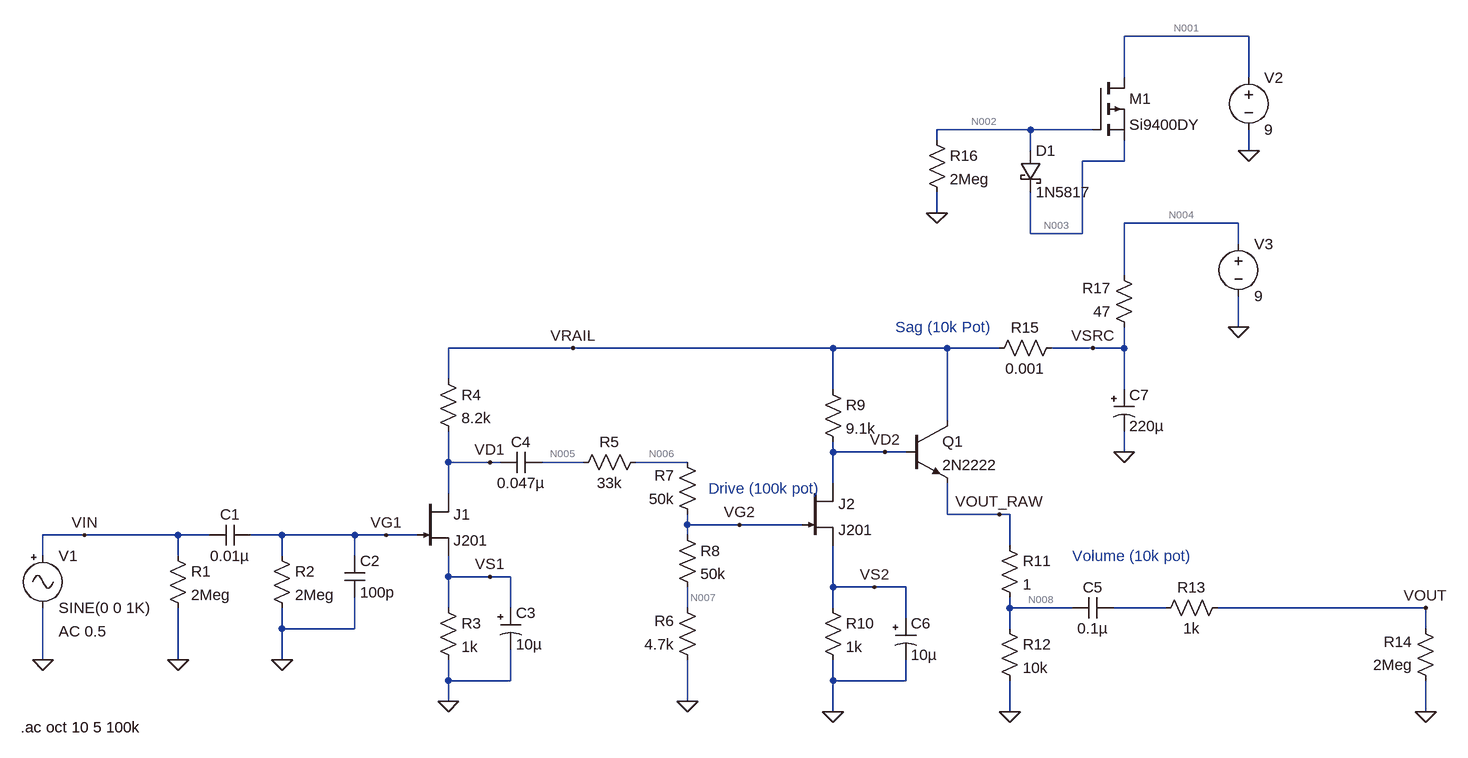
[diagram p0: schematic fairfield_barbershop.asc]
fairfield_barbershop.asc, the LTspice schematic file:
Version 4
SHEET 1 2060 680
WIRE 1664 -608 1472 -608
WIRE 1472 -544 1472 -608
WIRE 1664 -544 1664 -608
WIRE 1328 -464 1184 -464
WIRE 1424 -464 1328 -464
WIRE 1184 -448 1184 -464
WIRE 1328 -432 1328 -464
WIRE 1664 -432 1664 -464
WIRE 1472 -416 1472 -448
WIRE 1472 -416 1408 -416
WIRE 1184 -336 1184 -368
WIRE 1648 -320 1472 -320
WIRE 1328 -304 1328 -368
WIRE 1408 -304 1408 -416
WIRE 1408 -304 1328 -304
WIRE 1648 -288 1648 -320
WIRE 1472 -240 1472 -320
WIRE 1648 -160 1648 -208
WIRE 624 -128 432 -128
WIRE 1024 -128 624 -128
WIRE 1200 -128 1024 -128
WIRE 1280 -128 1200 -128
WIRE 1424 -128 1360 -128
WIRE 1472 -128 1472 -160
WIRE 1472 -128 1424 -128
WIRE 432 -80 432 -128
WIRE 1024 -64 1024 -128
WIRE 1472 -64 1472 -128
WIRE 1200 -16 1200 -128
WIRE 1024 32 1024 16
WIRE 1104 32 1024 32
WIRE 1136 32 1104 32
WIRE 1472 32 1472 0
WIRE 432 48 432 0
WIRE 496 48 432 48
WIRE 512 48 496 48
WIRE 640 48 576 48
WIRE 800 48 720 48
WIRE 1024 80 1024 32
WIRE 432 96 432 48
WIRE 1200 128 1200 80
WIRE 1280 128 1200 128
WIRE 1296 128 1280 128
WIRE 800 144 800 128
WIRE 880 144 800 144
WIRE 976 144 880 144
WIRE -128 160 -192 160
WIRE 16 160 -128 160
WIRE 64 160 16 160
WIRE 176 160 128 160
WIRE 288 160 176 160
WIRE 336 160 288 160
WIRE 384 160 336 160
WIRE 800 160 800 144
WIRE 1296 176 1296 128
WIRE -192 192 -192 160
WIRE 16 192 16 160
WIRE 176 192 176 160
WIRE 288 192 288 160
WIRE 432 224 432 192
WIRE 496 224 432 224
WIRE 528 224 496 224
WIRE 1024 240 1024 176
WIRE 1088 240 1024 240
WIRE 1136 240 1088 240
WIRE 432 272 432 224
WIRE 528 272 528 224
WIRE 800 272 800 240
WIRE 1024 272 1024 240
WIRE 1296 272 1296 256
WIRE 1392 272 1296 272
WIRE 1536 272 1456 272
WIRE 1936 272 1616 272
WIRE 1136 288 1136 240
WIRE 176 304 176 272
WIRE 288 304 288 256
WIRE 288 304 176 304
WIRE 1296 304 1296 272
WIRE 1936 304 1936 272
WIRE -192 352 -192 272
WIRE 16 352 16 272
WIRE 176 352 176 304
WIRE 432 384 432 352
WIRE 528 384 528 336
WIRE 528 384 432 384
WIRE 1024 384 1024 352
WIRE 1136 384 1136 352
WIRE 1136 384 1024 384
WIRE 432 416 432 384
WIRE 800 416 800 352
WIRE 1024 432 1024 384
WIRE 1296 432 1296 384
WIRE 1936 432 1936 384
FLAG -192 352 0
FLAG 16 352 0
FLAG 176 352 0
FLAG 432 416 0
FLAG 800 416 0
FLAG 1936 432 0
FLAG 1296 432 0
FLAG 1024 432 0
FLAG 1936 272 VOUT
FLAG -128 160 VIN
FLAG 1184 -336 0
FLAG 1472 32 0
FLAG 1664 -432 0
FLAG 624 -128 VRAIL
FLAG 1424 -128 VSRC
FLAG 880 144 VG2
FLAG 1104 32 VD2
FLAG 1280 128 VOUT_RAW
FLAG 1648 -160 0
FLAG 336 160 VG1
FLAG 496 48 VD1
FLAG 496 224 VS1
FLAG 1088 240 VS2
SYMBOL njf 384 96 R0
SYMATTR InstName J1
SYMATTR Value J201
SYMBOL npn 1136 -16 R0
SYMATTR InstName Q1
SYMATTR Value 2N2222
SYMBOL pmos 1424 -544 R0
SYMATTR InstName M1
SYMATTR Value Si9400DY
SYMBOL Misc\\signal -192 176 R0
WINDOW 123 24 132 Left 2
WINDOW 39 0 0 Left 0
SYMATTR InstName V1
SYMATTR Value SINE(0 0 1K)
SYMATTR Value2 AC 0.5
SYMBOL res 0 176 R0
SYMATTR InstName R1
SYMATTR Value 2Meg
SYMBOL cap 128 144 R90
WINDOW 0 0 32 VBottom 2
WINDOW 3 32 32 VTop 2
SYMATTR InstName C1
SYMATTR Value 0.01µ
SYMATTR SpiceLine V=50 Irms=0 Rser=0 Lser=0 mfg="Murata" pn="GCM155R71H103KA55" type="X7R"
SYMBOL njf 976 80 R0
SYMATTR InstName J2
SYMATTR Value J201
SYMBOL res 160 176 R0
SYMATTR InstName R2
SYMATTR Value 2Meg
SYMBOL cap 272 256 M180
WINDOW 0 24 56 Left 2
WINDOW 3 24 8 Left 2
SYMATTR InstName C2
SYMATTR Value 100p
SYMATTR SpiceLine V=50 Irms=20.8m Rser=5.448 Lser=0 mfg="KEMET" pn="C0603C101K5RAC" type="X7R"
SYMBOL res 416 256 R0
SYMATTR InstName R3
SYMATTR Value 1k
SYMBOL polcap 512 272 R0
WINDOW 3 24 56 Left 2
SYMATTR InstName C3
SYMATTR Value 10µ
SYMATTR Description Capacitor
SYMATTR Type cap
SYMATTR SpiceLine V=25 Irms=39m Rser=2.8 Lser=0 mfg="Nichicon" pn="UPR1E100MAH" type="Al electrolytic"
SYMBOL res 416 -96 R0
SYMATTR InstName R4
SYMATTR Value 8.2k
SYMBOL cap 576 32 R90
WINDOW 0 0 32 VBottom 2
WINDOW 3 32 32 VTop 2
SYMATTR InstName C4
SYMATTR Value 0.047µ
SYMATTR SpiceLine V=25 Irms=0 Rser=0 Lser=0 mfg="Murata" pn="GCM155R71E473KA55" type="X7R"
SYMBOL res 736 32 R90
WINDOW 0 0 56 VBottom 2
WINDOW 3 32 56 VTop 2
SYMATTR InstName R5
SYMATTR Value 33k
SYMBOL res 816 368 R180
WINDOW 0 36 76 Left 2
WINDOW 3 36 40 Left 2
SYMATTR InstName R6
SYMATTR Value 4.7k
SYMBOL res 816 144 R180
WINDOW 0 36 76 Left 2
WINDOW 3 36 40 Left 2
SYMATTR InstName R7
SYMATTR Value 50k
SYMBOL res 784 144 R0
SYMATTR InstName R8
SYMATTR Value 50k
SYMBOL res 1008 -80 R0
SYMATTR InstName R9
SYMATTR Value 9.1k
SYMBOL res 1008 256 R0
SYMATTR InstName R10
SYMATTR Value 1k
SYMBOL res 1280 160 R0
SYMATTR InstName R11
SYMATTR Value 1
SYMBOL res 1280 288 R0
SYMATTR InstName R12
SYMATTR Value 10k
SYMBOL cap 1456 256 R90
WINDOW 0 0 32 VBottom 2
WINDOW 3 32 32 VTop 2
SYMATTR InstName C5
SYMATTR Value 0.1µ
SYMATTR SpiceLine V=25 Irms=0 Rser=0 Lser=0 mfg="Murata" pn="GCM155R71E104KE02" type="X7R"
SYMBOL res 1632 256 R90
WINDOW 0 0 56 VBottom 2
WINDOW 3 32 56 VTop 2
SYMATTR InstName R13
SYMATTR Value 1k
SYMBOL res 1952 400 R180
WINDOW 0 36 76 Left 2
WINDOW 3 36 40 Left 2
SYMATTR InstName R14
SYMATTR Value 2Meg
SYMBOL polcap 1120 288 R0
WINDOW 3 24 56 Left 2
SYMATTR InstName C6
SYMATTR Value 10µ
SYMATTR Description Capacitor
SYMATTR Type cap
SYMATTR SpiceLine V=25 Irms=39m Rser=2.8 Lser=0 mfg="Nichicon" pn="UPR1E100MAH" type="Al electrolytic"
SYMBOL res 1376 -144 R90
WINDOW 0 0 56 VBottom 2
WINDOW 3 32 56 VTop 2
SYMATTR InstName R15
SYMATTR Value 0.001
SYMBOL res 1488 -144 R180
WINDOW 0 36 76 Left 2
WINDOW 3 36 40 Left 2
SYMATTR InstName R17
SYMATTR Value 47
SYMBOL voltage 1664 -560 R0
WINDOW 123 0 0 Left 0
WINDOW 39 0 0 Left 0
SYMATTR InstName V2
SYMATTR Value 9
SYMBOL res 1168 -464 R0
SYMATTR InstName R16
SYMATTR Value 2Meg
SYMBOL polcap 1456 -64 R0
WINDOW 3 24 56 Left 2
SYMATTR InstName C7
SYMATTR Value 220µ
SYMATTR Description Capacitor
SYMATTR Type cap
SYMATTR SpiceLine V=25 Irms=250m Rser=0.35 Lser=0 mfg="Nichicon" pn="UPR1E221MPH" type="Al electrolytic"
SYMBOL schottky 1312 -432 R0
SYMATTR InstName D1
SYMATTR Value 1N5817
SYMATTR Description Diode
SYMATTR Type diode
SYMBOL voltage 1648 -304 R0
WINDOW 123 0 0 Left 0
WINDOW 39 0 0 Left 0
SYMATTR InstName V3
SYMATTR Value 9
TEXT 832 88 Left 2 ;Drive (100k pot)
TEXT 1120 -160 Left 2 ;Sag (10k Pot)
TEXT 1392 192 Left 2 ;Volume (10k pot)
TEXT -226 456 Left 2 !.ac oct 10 5 100k

The netlist it stands for:
* fairfield_barbershop.asc
J1 VD1 VG1 VS1 J201
Q1 VRAIL VD2 VOUT_RAW 0 2N2222
M1 N001 N002 N003 N003 Si9400DY
V1 VIN 0 SINE(0 0 1K) AC 0.5
R1 VIN 0 2Meg
C1 VG1 VIN 0.01µ V=50 Irms=0 Rser=0 Lser=0 mfg="Murata" pn="GCM155R71H103KA55" type="X7R"
J2 VD2 VG2 VS2 J201
R2 VG1 0 2Meg
C2 0 VG1 100p V=50 Irms=20.8m Rser=5.448 Lser=0 mfg="KEMET" pn="C0603C101K5RAC" type="X7R"
R3 VS1 0 1k
C3 VS1 0 10µ V=25 Irms=39m Rser=2.8 Lser=0 mfg="Nichicon" pn="UPR1E100MAH" type="Al electrolytic"
R4 VRAIL VD1 8.2k
C4 N005 VD1 0.047µ V=25 Irms=0 Rser=0 Lser=0 mfg="Murata" pn="GCM155R71E473KA55" type="X7R"
R5 N006 N005 33k
R6 0 N007 4.7k
R7 VG2 N006 50k
R8 VG2 N007 50k
R9 VRAIL VD2 9.1k
R10 VS2 0 1k
R11 VOUT_RAW N008 1
R12 N008 0 10k
C5 N009 N008 0.1µ V=25 Irms=0 Rser=0 Lser=0 mfg="Murata" pn="GCM155R71E104KE02" type="X7R"
R13 VOUT N009 1k
R14 0 VOUT 2Meg
C6 VS2 0 10µ V=25 Irms=39m Rser=2.8 Lser=0 mfg="Nichicon" pn="UPR1E100MAH" type="Al electrolytic"
R15 VSRC VRAIL 0.001
R17 VSRC N004 47
V2 N001 0 9
R16 N002 0 2Meg
C7 VSRC 0 220µ V=25 Irms=250m Rser=0.35 Lser=0 mfg="Nichicon" pn="UPR1E221MPH" type="Al electrolytic"
D1 N002 N003 1N5817
V3 N004 0 9
.model D D
.lib standard.dio
.model NPN NPN
.model PNP PNP
.lib standard.bjt
.model NJF NJF
.model PJF PJF
.lib standard.jft
.model NMOS NMOS
.model PMOS PMOS
.lib standard.mos
* Drive (100k pot)
* Sag (10k Pot)
* Volume (10k pot)
.ac oct 10 5 100k
.backanno
.end

* Results of the author's LTspice run, read from the files saved beside the schematic
* Operating Point, zero values left out:
*   V(vd1) = 6.007 V
*   V(vg1) = 12.74 µV
*   V(vs1) = 358 mV
*   V(vrail) = 8.943 V
*   V(vd2) = 5.666 V
*   V(vout_raw) = 5.03 V
*   V(n001) = 9 V
*   V(n002) = 8.661 V
*   V(n003) = 8.667 V
*   V(vg2) = 329.7 nV
*   V(vs2) = 357.6 mV
*   V(n005) = 329.7 nV
*   V(n006) = 329.7 nV
*   V(n007) = 28.33 nV
*   V(n008) = 5.029 V
*   V(vsrc) = 8.943 V
*   V(n004) = 9 V
*   Ic(Q1) = 500.5 µA
*   Ib(Q1) = 2.427 µA
*   Ie(Q1) = -502.9 µA
*   Id(M1) = 4.331 µA
*   Ig(M1) = -155.4 pA
*   Is(M1) = -4.331 µA
*   I(D1) = -4.331 µA
*   Id(J2) = 357.6 µA
*   Ig(J2) = -6.028 pA
*   Is(J2) = -357.6 µA
*   Id(J1) = 358 µA
*   Ig(J1) = -6.369 pA
*   Is(J1) = -358 µA
*   I(R16) = 4.331 µA
*   I(R17) = -1.219 mA
*   I(R15) = 1.219 mA
*   I(R12) = 502.9 µA
*   I(R11) = 502.9 µA
*   I(R10) = 357.6 µA
*   I(R9) = 360.1 µA
*   I(R8) = 6.028 pA
*   I(R6) = -6.028 pA
*   I(R4) = 358 µA
*   I(R3) = 358 µA
*   I(R2) = 6.369 pA
*   I(V3) = -1.219 mA
*   I(V2) = -4.331 µA
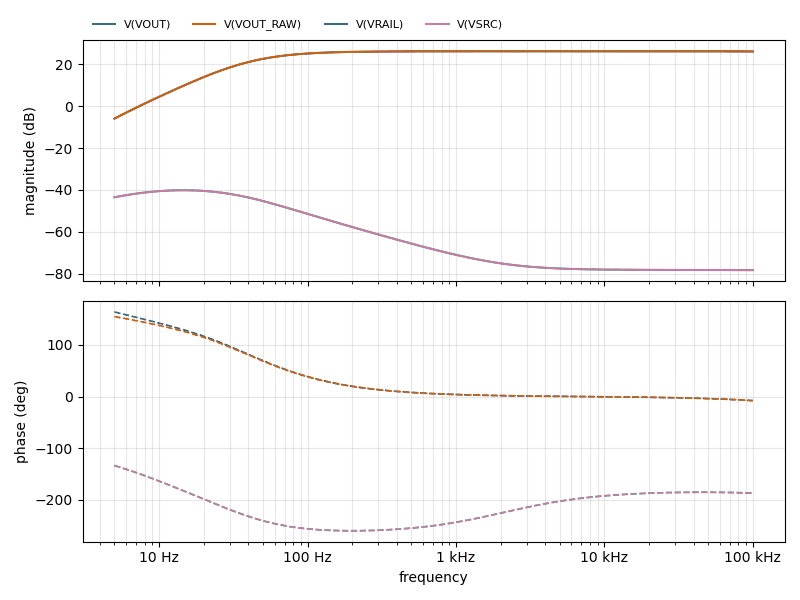
[diagram p1: AC Analysis of fairfield_barbershop.asc, plotted from the saved traces]
* AC Analysis, 1 run:
*   V(VOUT): -6.03 dB at 5 Hz, 26.02 dB at 100 kHz, peak 26.10 dB at 6.303 kHz, 3 dB below the peak at 55.73 Hz
*   V(VOUT_RAW): -5.92 dB at 5 Hz, 26.03 dB at 100 kHz, peak 26.10 dB at 6.303 kHz, 3 dB below the peak at 55.72 Hz
*   V(VRAIL): -43.48 dB at 5 Hz, -78.21 dB at 100 kHz, peak -40.13 dB at 14.14 Hz, 3 dB below the peak at 5.309 Hz and 37.28 Hz
*   V(VSRC): -43.48 dB at 5 Hz, -78.23 dB at 100 kHz, peak -40.13 dB at 14.14 Hz, 3 dB below the peak at 5.309 Hz and 37.28 Hz